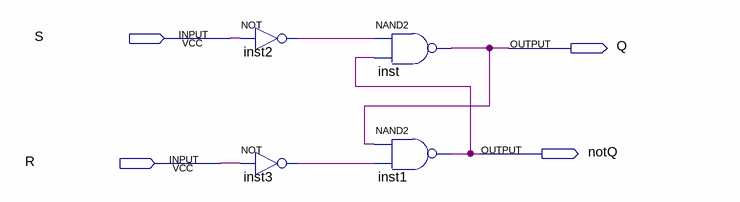
[diagram p0: schematic sheet]
// Quartus schematic lab9step1part2.bdf as structural Verilog: 4 symbols, 4 pins
module lab9step1part2 (
  input  S,
  input  R,
  output Q,
  output notQ
);

  wire inst2_out, inst3_out;

  not inst2 (inst2_out, S);
  not inst3 (inst3_out, R);
  nand inst (Q, inst2_out, notQ);
  nand inst1 (notQ, Q, inst3_out);
endmodule
